# Altium schematic sheet NIXIE_2.SchDoc
size A4; SheetNumber: 5; SheetTotal: 6
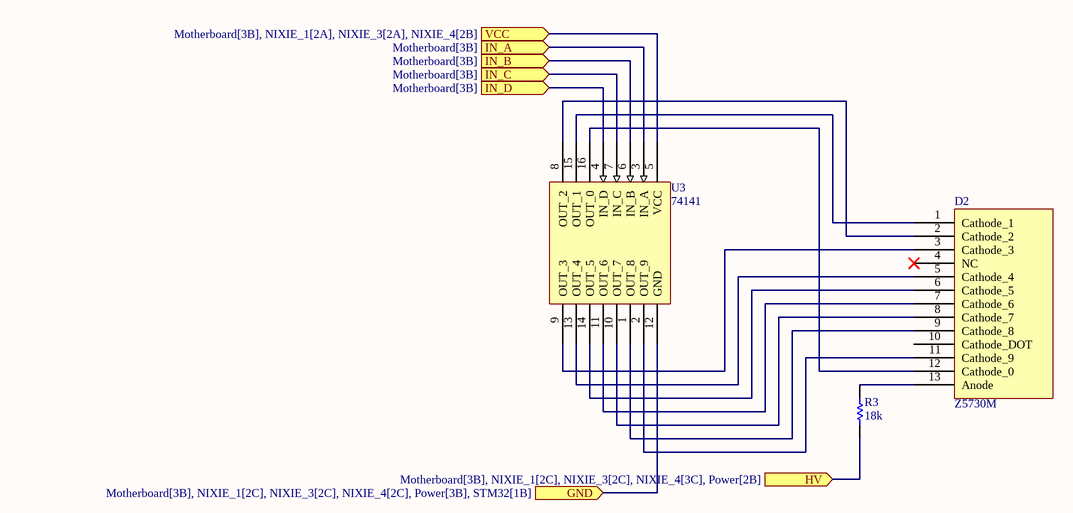
[diagram p0: NIXIE_2.SchDoc]

## Parts
D2  Z5730M  [Z5730M]
R3  18k  [RESC2013X60X40LL20T25]
U3  74141  [DIP-16]

## Ports
GND (in, see Motherboard[3B], NIXIE_1[2C], NIXIE_3[2C], NIXIE_4[2C], Power[3B], STM32[1B]), HV (in, see Motherboard[3B], NIXIE_1[2C], NIXIE_3[2C], NIXIE_4[3C], Power[2B]), IN_A (in, see Motherboard[3B]), IN_B (in, see Motherboard[3B]), IN_C (in, see Motherboard[3B]), IN_D (in, see Motherboard[3B]), VCC (in, see Motherboard[3B], NIXIE_1[2A], NIXIE_3[2A], NIXIE_4[2B])

## Nets
GND: U3.12(GND) ; port GND
HV: R3.1 ; port HV
IN_A: U3.3(IN_A) ; port IN_A
IN_B: U3.6(IN_B) ; port IN_B
IN_C: U3.7(IN_C) ; port IN_C
IN_D: U3.4(IN_D) ; port IN_D
VCC: U3.5(VCC) ; port VCC
NetD2_1: D2.1(Cathode_1) U3.15(OUT_1)
NetD2_2: D2.2(Cathode_2) U3.8(OUT_2)
NetD2_3: D2.3(Cathode_3) U3.9(OUT_3)
NetD2_5: D2.5(Cathode_4) U3.13(OUT_4)
NetD2_6: D2.6(Cathode_5) U3.14(OUT_5)
NetD2_7: D2.7(Cathode_6) U3.11(OUT_6)
NetD2_8: D2.8(Cathode_7) U3.10(OUT_7)
NetD2_9: D2.9(Cathode_8) U3.1(OUT_8)
NetD2_11: D2.11(Cathode_9) U3.2(OUT_9)
NetD2_12: D2.12(Cathode_0) U3.16(OUT_0)
NetD2_13: D2.13(Anode) R3.2

Not connected (* = marked no-connect by the designer): D2 4(NC)* 10(Cathode_DOT)

## Library data of the parts
R3 = CMP-2001-00606-1: Manufacturer: Panasonic; Part Number: ERA6AEB183V